# EAGLE schematic NeoJointV2A-090 (EAGLE 6.6.0)
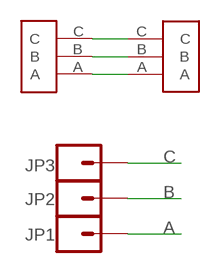
[diagram p0: schematic, sheet 1]

## Parts
JP1  M01PTH  [1X01]
JP2  M01PTH  [1X01]
JP3  M01PTH  [1X01]
U$1  LED_STRIP_3P  [LEDSTRIP-3P]
U$2  LED_STRIP_3P  [LEDSTRIP-3P]

## Nets
A: JP1.1 U$1.A U$2.A
B: JP2.1 U$1.B U$2.B
C: JP3.1 U$1.C U$2.C

## Library data of the parts
JP1-JP3 = SparkFun-Connectors:M01: Header 1 Standard 1-pin 0.1" header. Use with straight break away headers (SKU : PRT-00116), right angle break away headers (PRT-00553), swiss pins (PRT-00743), machine pins (PRT-00117), and female headers (PRT-00115).
U$1 U$2 = todstuff:LED_STRIP_3P